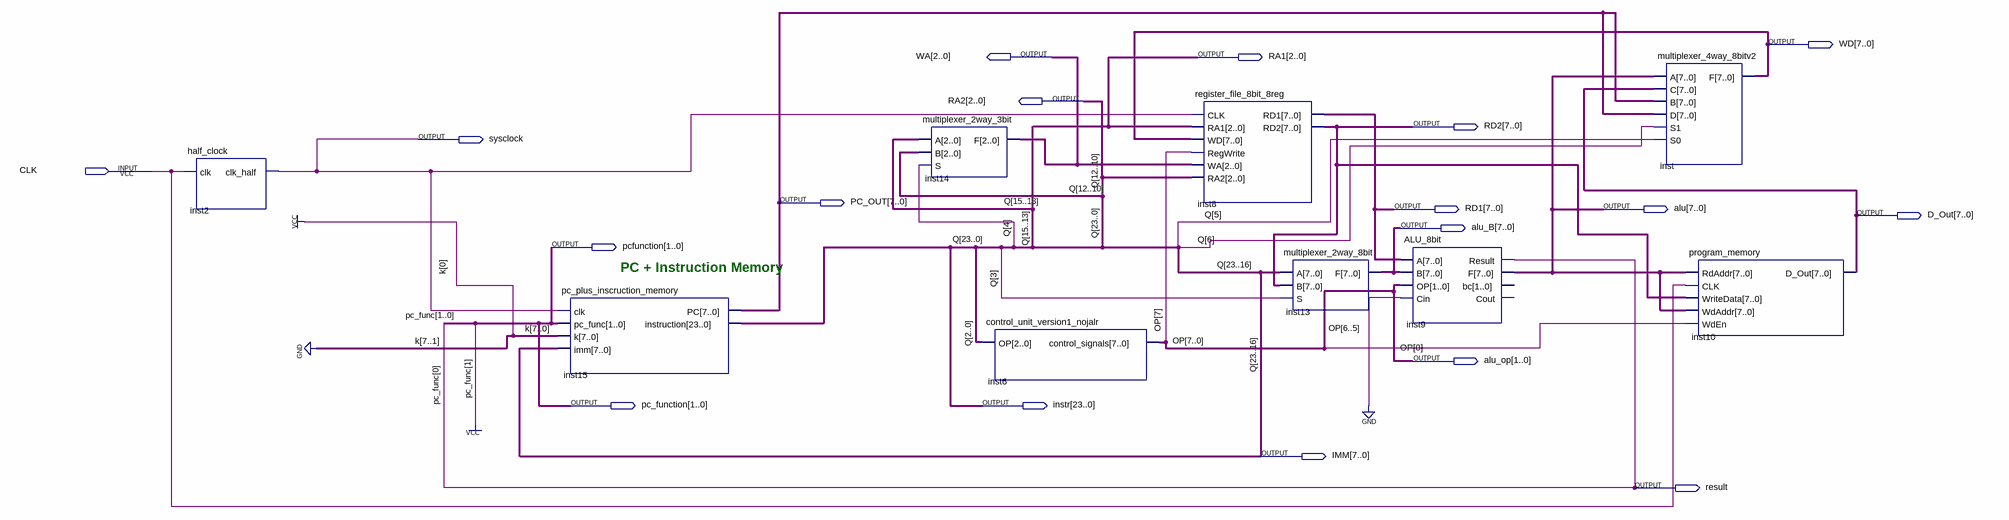
[diagram p0: schematic sheet]
// Quartus schematic cpu_design.bdf as structural Verilog: 9 symbols, 18 pins
module cpu_design (
  input  CLK,
  output [7:0] WD,
  output [2:0] WA,
  output [2:0] RA1,
  output [2:0] RA2,
  output [7:0] RD2,
  output sysclock,
  output [7:0] PC_OUT,
  output [7:0] RD1,
  output [7:0] alu,
  output [7:0] D_Out,
  output [7:0] alu_B,
  output [1:0] pcfunction,
  output [1:0] alu_op,
  output [1:0] pc_function,
  output [23:0] instr,
  output [7:0] IMM,
  output result
);

  wire [7:0] OP;

  half_clock inst2 (.clk(CLK), .clk_half(sysclock));
  pc_plus_inscruction_memory inst15 (
    .clk(sysclock), .pc_func({1'b1, pc_function[0]}), .k(8'b00000001), .imm(IMM), .PC(PC_OUT),
    .instruction({IMM, instr[15:0]}));
  multiplexer_2way_3bit inst14 (.A(instr[15:13]), .B(instr[12:10]), .S(instr[4]), .F(WA));
  control_unit_version1_nojalr inst6 (.OP(instr[2:0]), .control_signals({OP[7], alu_op, OP[4:0]}));
  register_file_8bit_8reg inst8 (
    .CLK(sysclock), .RA1(instr[15:13]), .WD(WD), .RegWrite(OP[7]), .WA(WA), .RA2(instr[12:10]), .RD1(RD1),
    .RD2(RD2));
  multiplexer_2way_8bit inst13 (.A(IMM), .B(RD2), .S(instr[3]), .F(alu_B));
  ALU_8bit inst9 (.A(RD1), .B(alu_B), .OP(alu_op), .Cin(1'b0), .Result(pc_function[0]), .F(alu));  // open: bc, Cout
  multiplexer_4way_8bitv2 inst (.A(alu), .C(D_Out), .B(PC_OUT), .D(PC_OUT), .S1(instr[6]), .S0(instr[5]), .F(WD));
  program_memory inst10 (.RdAddr(alu), .CLK(CLK), .WriteData(RD2), .WdAddr(alu), .WdEn(OP[0]), .D_Out(D_Out));

  assign instr[23:16] = IMM;
  assign pc_function[1] = 1'b1;
  assign pcfunction = {1'b1, pc_function[0]};
  assign RA1 = instr[15:13];
  assign RA2 = instr[12:10];
  assign result = pc_function[0];

  // Other names for the same wires on the sheet: Q[23:0] = {IMM, instr[15:0]}; OP[6:5] = alu_op;
  //   pc_func[0] = pc_function[0]

  // Notes on the sheet:
  //   PC + Instruction Memory
endmodule
